# Altium project Keypadmacro.PrjPcb
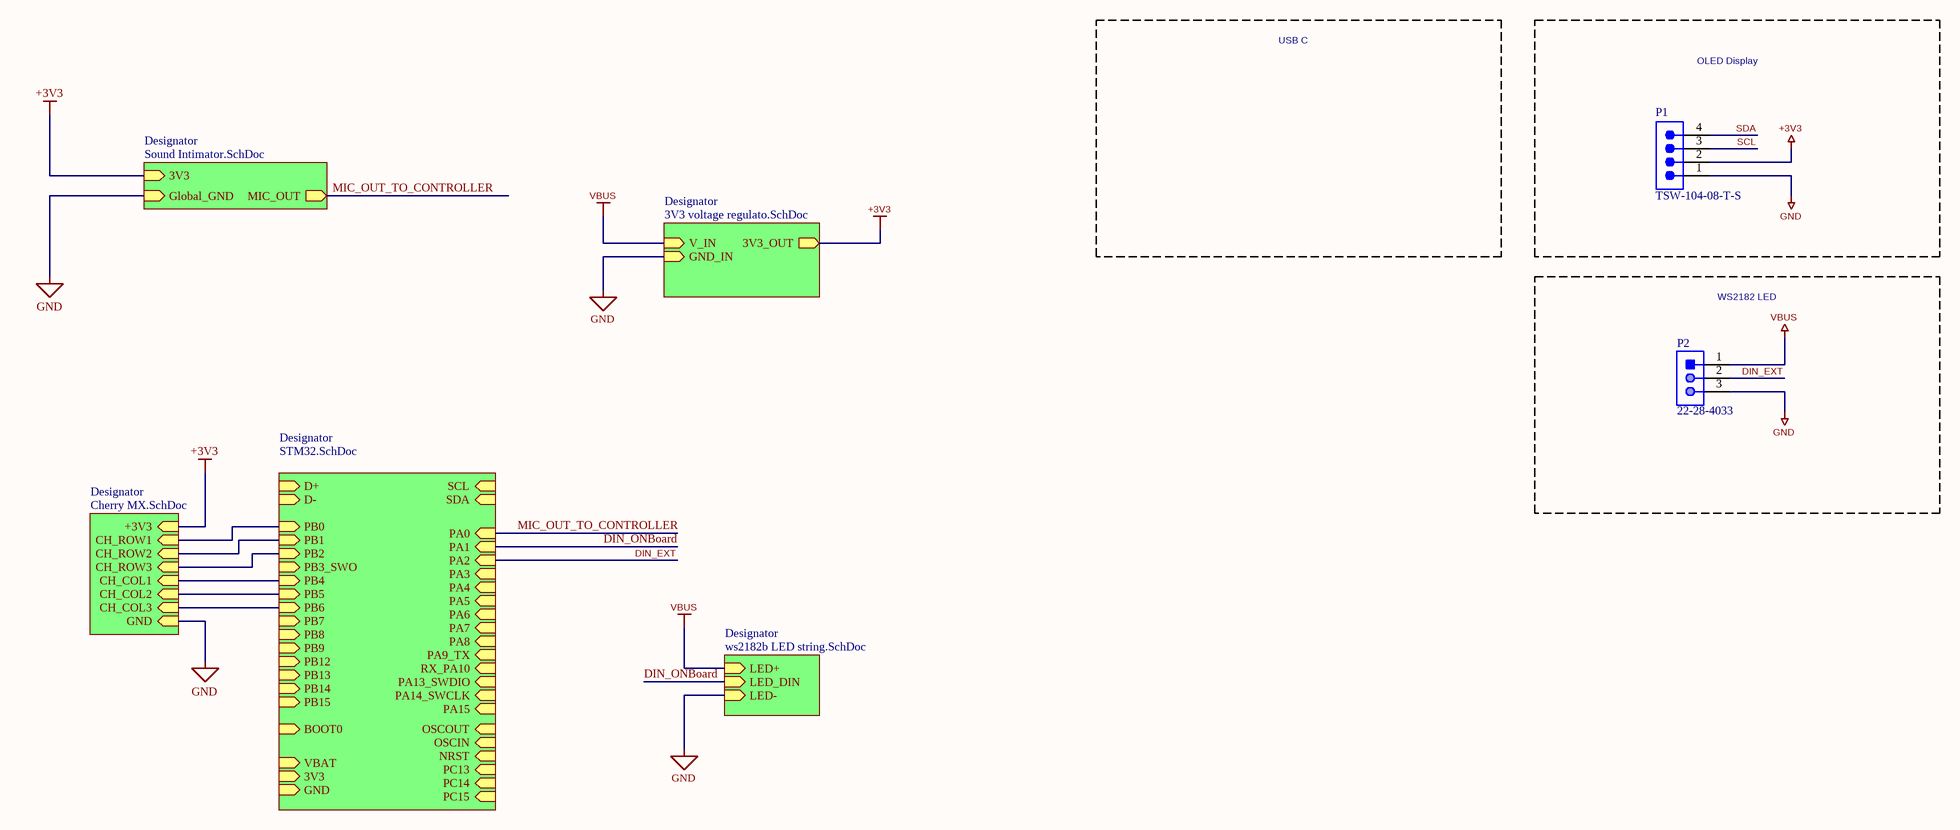
[diagram p0: Keypadmacro.SchDoc]
6 sheets, 73 parts. Net scope: hierarchical (ports join the sheet entries above them; power ports are global).
Board file: Keypadmacro.PcbDoc
Sheets:
  Keypadmacro.SchDoc
    Designator = Sound Intimator.SchDoc
    Designator = STM32.SchDoc
    Designator = Cherry MX.SchDoc
    Designator = 3V3 voltage regulato.SchDoc
    Designator = ws2182b LED string.SchDoc

## Sheet Keypadmacro.SchDoc
size 419 x 297 mm

### Parts
P1  TSW-104-08-T-S  [SMTC-TSW-104-08-X-S]
P2  22-28-4033  [MOLX-22-28-4033_V]

### Blocks framed on the sheet
OLED Display: P1
WS2182 LED: P2

### Sub-sheets
Designator = Sound Intimator.SchDoc: 3V3 (in), Global_GND (in), MIC_OUT (out)
Designator = STM32.SchDoc: 3V3 (in), VBAT (in), GND (in), D+ (in), D- (in), BOOT0 (in), NRST (in), PA0 (in), PA9_TX (in), PA6 (in), PA7 (in), PA1 (in), PA5 (in), PA3 (in), PA2 (in), PA4 (in), PA8 (in), PB13 (in), PB6 (in), PB9 (in), PB12 (in), PB14 (in), PB0 (in), PB4 (in), PB3_SWO (in), PB1 (in), PB8 (in), PB15 (in), PB5 (in), PB2 (in), PB7 (in), RX_PA10 (in), PC14 (in), PC15 (in), PA15 (in), PC13 (in), SCL (in), OSCIN (in), SDA (in), PA13_SWDIO (in), PA14_SWCLK (in), OSCOUT (in)
Designator = Cherry MX.SchDoc: CH_ROW2 (in), CH_COL3 (in), CH_ROW3 (in), GND (in), +3V3 (in), CH_COL2 (in), CH_ROW1 (in), CH_COL1 (in)
Designator = 3V3 voltage regulato.SchDoc: 3V3_OUT (out), GND_IN (in), V_IN (in)
Designator = ws2182b LED string.SchDoc: LED+ (in), LED_DIN (in), LED- (in)

### Nets
+3V3: P1.2 ; sheet Designator/3V3, sheet Designator/3V3, sheet Designator/VBAT, sheet Designator/+3V3, sheet Designator/3V3_OUT  [project net +3.3V]
GND: P1.1 P2.3 ; sheet Designator/Global_GND, sheet Designator/GND, sheet Designator/GND, sheet Designator/GND_IN, sheet Designator/LED-
VBUS: P2.1 ; sheet Designator/V_IN, sheet Designator/LED+  [project net +BATT]
CH_COL1: sheet Designator/PB4, sheet Designator/CH_COL1
CH_COL2: sheet Designator/PB5, sheet Designator/CH_COL2
CH_COL3: sheet Designator/PB6, sheet Designator/CH_COL3
CH_ROW1: sheet Designator/PB0, sheet Designator/CH_ROW1
CH_ROW2: sheet Designator/PB1, sheet Designator/CH_ROW2
CH_ROW3: sheet Designator/PB2, sheet Designator/CH_ROW3
DIN_EXT: P2.2 ; sheet Designator/PA2
DIN_ONBoard: sheet Designator/PA1, sheet Designator/LED_DIN  [project net D_IN]
MIC_OUT_TO_CONTROLLER: sheet Designator/MIC_OUT, sheet Designator/PA0
SCL: P1.3
SDA: P1.4

### Notes on the sheet
- USB C
- 1
- 2
- 3
- 4
- 5
- 6
- 7
- 8
- A
- B
- C
- D
- E
- Title:
- File: Keypadmacro.sch
- Sheet: /
- F
- KiCad E.D.A.  kicad (5.1.4)-1
- Size: A3
- Date:
- Rev:
- Id: 1/4

### Library data of the parts
P1 = CMP-1024-00356-1: 0.025" SQ Post Header, Through-hole, Vertical, -55 to 105 degC, 2.54 mm Pitch, 4-Pin, Male, RoHS; Manufacturer: Samtec; Pitch: 2.54 mm; PackageDescription: .025[0.64] SQ. Post Terminal Strip Assembly; ComponentLink2URL: http://www.samtec.com/documents/webfiles/pdf/TSW_TH.PDF; ComponentLink3URL: http://www.samtec.com/documents/webfiles/cpdf/TSW-XXX-XX-XXX-X-XX-XXX-MKT.pdf; PackageVersion: DM, 8/1988; ComponentLink3Description: Package Specification; DatasheetVersion: F-214; Orientation: Vertical; RoHS: True; Mounting Technology: Through-hole; ComponentLink1URL: http://www.samtec.com; PartNumber: TSW-104-08-T-S; ComponentLink1Description: Manufacturer URL; Temperature Range: -55 to 105 degC; ComponentLink2Description: Datasheet; PackageReference: TSW-104-08-X-S
P2 = CMP-1676-00001-5: Male Header, Pitch 2.54 mm, 1 x 3 Position, Height 8.38 mm, Tail Length 3.18 mm, RoHS, Bulk; Manufacturer: Molex; Rows: 1; Voltage Rating: 250 V; Current Rating: 4 A; Min Operating Temperature: 0 degC; Lead Pitch: 0.1 inch; Packaging: Bulk; Contact Finish: Gold; RoHSCompliant: true; Contact Material: Brass; PackageReference: 22-28-4033; REACH SVHC: Unknown; PackageDescription: Male Header, Pitch 2.54 mm, 1 x 3 Position, Height 8.38 mm, Tail Length 3.18 mm; ComponentLink2URL: http://www.molex.com/pdm_docs/sd/022284033_sd.pdf; Height: 8.38 mm; Mounting Technology: Through Hole; ComponentLink1Description: Manufacturer URL; Length: 7.62 mm; Mount: Through Hole; DatasheetVersion: Rev. G, 01/2012; Max Operating Temperature: 75 degC; ComponentLink2Description: Datasheet; Colour: Black; Pins: 3; Contact Plating: Gold; Package Quantity: 1; ComponentLink1URL: http://www.molex.com/

## Sheet Sound Intimator.SchDoc
size 297 x 210 mm
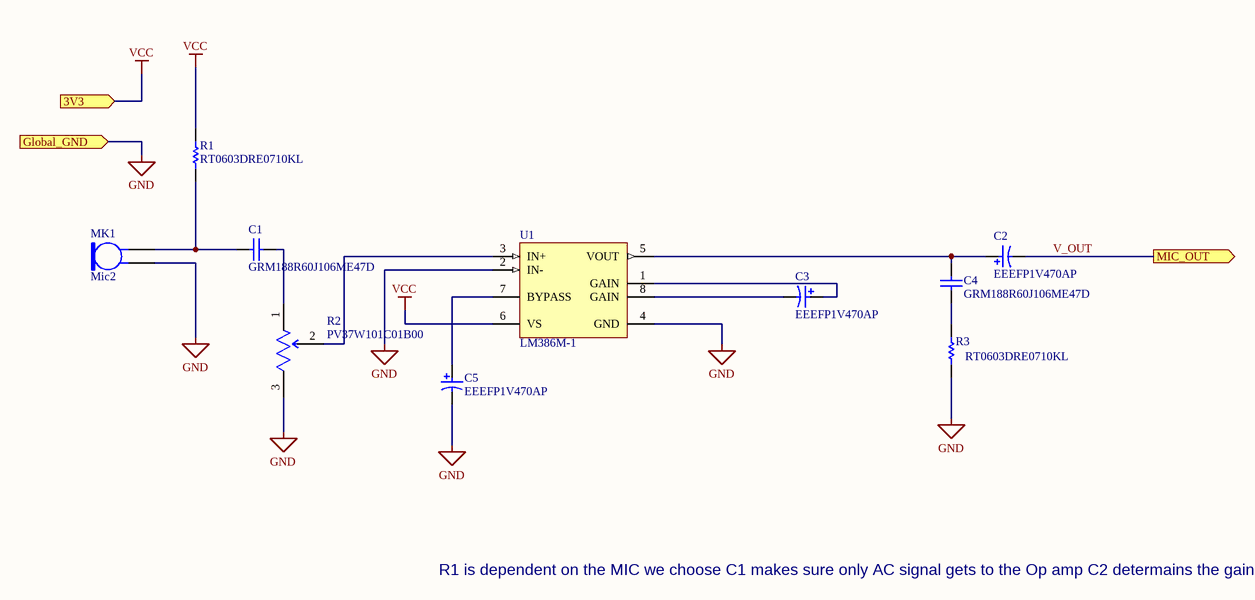
[diagram p1: Sound Intimator.SchDoc]

### Parts
C1  GRM188R60J106ME47D  [CAPC1608X90X35NL10T15]
C2  EEEFP1V470AP  [PNSC-FP-V-D_V]
C3  EEEFP1V470AP  [PNSC-FP-V-D_V]
C4  GRM188R60J106ME47D  [CAPC1608X90X35NL10T15]
C5  EEEFP1V470AP  [PNSC-FP-V-D_V]
MK1  Mic2  [PIN2]
R1  RT0603DRE0710KL  [RESC1608X55X25ML10T15]
R2  PV37W101C01B00  [FP-PV37W101C01B00-MFG]
R3  RT0603DRE0710KL  [RESC1608X55X25ML10T15]
U1  LM386M-1  [D0008A_M]

### Ports
3V3 (in), Global_GND (in), MIC_OUT (out)

### Nets
GND: C5.2 MK1.1 R2.3 R3.1 U1.2(IN-) U1.4(GND) ; port Global_GND
VCC: R1.2 U1.6(VS) ; port 3V3  [project net +3.3V]
V_OUT: C2.2 ; port MIC_OUT  [project net MIC_OUT_TO_CONTROLLER]
NetC1_1: C1.1 MK1.2 R1.1
NetC1_2: C1.2 R2.1
NetC2_1: C2.1 C4.2 U1.5(VOUT)
NetC3_1: C3.1 U1.1(GAIN)
NetC3_2: C3.2 U1.8(GAIN)
NetC4_1: C4.1 R3.2
NetC5_1: C5.1 U1.7(BYPASS)
NetR2_2: R2.2 U1.3(IN+)

### Notes on the sheet
- R1 is dependent on the MIC we choose
  C1 makes sure only AC signal gets to the Op amp
  C2 determains the gain of the OP Amp 20 to 200 gain
  C7 Is the Bypass Capacitor for stability of the op amp
  C3 removes the DC offset of the Output
- 1
- 2
- 3
- 4
- 5
- 6
- A
- B
- C
- D
- Title:
- File: Sound Intimator.sch
- Sheet: /
- KiCad E.D.A.  kicad (5.1.4)-1
- Size: A4
- Date:
- Rev:
- Id: 2/4

### Library data of the parts
C1 C4 = CMP-2006-02792-1: Manufacturer: Murata; Part Number: GRM188R60J106ME47D
C2 C3 C5 = CMP-2000-06216-1: Aluminum Electrolytic Capacitor, 47 uF, +/- 20%, 35 V, 2-Pin SMD (Size Code D), -55 to 105 degC, RoHS, Tape and Reel; Manufacturer: Panasonic; Lifetime@Temperature: 2000Hrs@105°C; Capacitance: 47µF; Type: Can; Rated Voltage: 35V; Ripple Current: 300mA; ESR (Equivalent Series Resistance): 0.26O; Package Reference: FP-V-D; Package Description: 2-Pin Electrolytic Aluminum Capacitor, Body 6.6 x 6.6 mm; Datasheet URL: http://industrial.panasonic.com/cdbs/www-data/pdf/RDE0000/ABA0000C1184.pdf; Series: FP; Operating Temp Range: -55to+105°C; Operating Temp-Max: 105°C; Datasheet Version: 03/2016; Manufacturer URL: http://www.panasonic.com/; Package URL: http://industrial.panasonic.com/cdbs/www-data/pdf/RDE0000/DME0000COL48.pdf; Case Size/Dimension: Ø6.3x5.8mm; Mounting Technology: SurfaceMount
MK1 = Mic2: Microphone; Published: 24-Mar-1999; LatestRevisionDate: 17-Jul-2002; LatestRevisionNote: Re-released for DXP Platform.; PackageReference: PIN2; Publisher: Altium Limited
R1 R3 = CMP-2000-04608-1: Manufacturer: Yageo; Part Number: RT0603DRE0710KL
R2 = CMP-06028-000002-1: TRIMMER 100 OHM 0.25W PC PIN TOP; Power Rating: 250mW; Number of Turns: 12; Temperature Coefficient: 150ppm/°C; Resistance: 100R; Tolerance: 10%; Max Operating Temperature: 125°C; Lead Free: Lead Free; Mount: Through Hole; Width: 0.157inch; Composition: Cermet; Package Quantity: 50; Color: Grey; Weight: 340mg; Max Power Dissipation: 250mW; Radiation Hardening: No; Min Operating Temperature: -55°C; Height: 0.264inch; Packaging: Bulk; Length: 0.252inch; Termination: PC Pin; Taper: Linear
U1 = CMP-0057-00421-3: Low Voltage Audio Power Amplifier, 8-pin Narrow SOIC; Manufacturer: Texas Instruments; PackageTopMarking: NSZXTT*LM386*M-1; CompType: Audio IC; PowerWise: N; ComponentLink1Description: Datasheet URL; Code_IPC: SOIC127P600-8; PackageDescription: SOIC Narrow, 4.9 x 3.9 x 1.45mm, 8 Lead, 1.27mm Pitch; Code_JEDEC: MS-012-AA; PinCount: 8; ComponentLink1URL: http://www.ti.com/general/docs/lit/getliterature.tsp?genericPartNumber=LM386&fileType=pdf; RoHS: N; PackageReference: D0008A

## Sheet STM32.SchDoc
size 297 x 210 mm
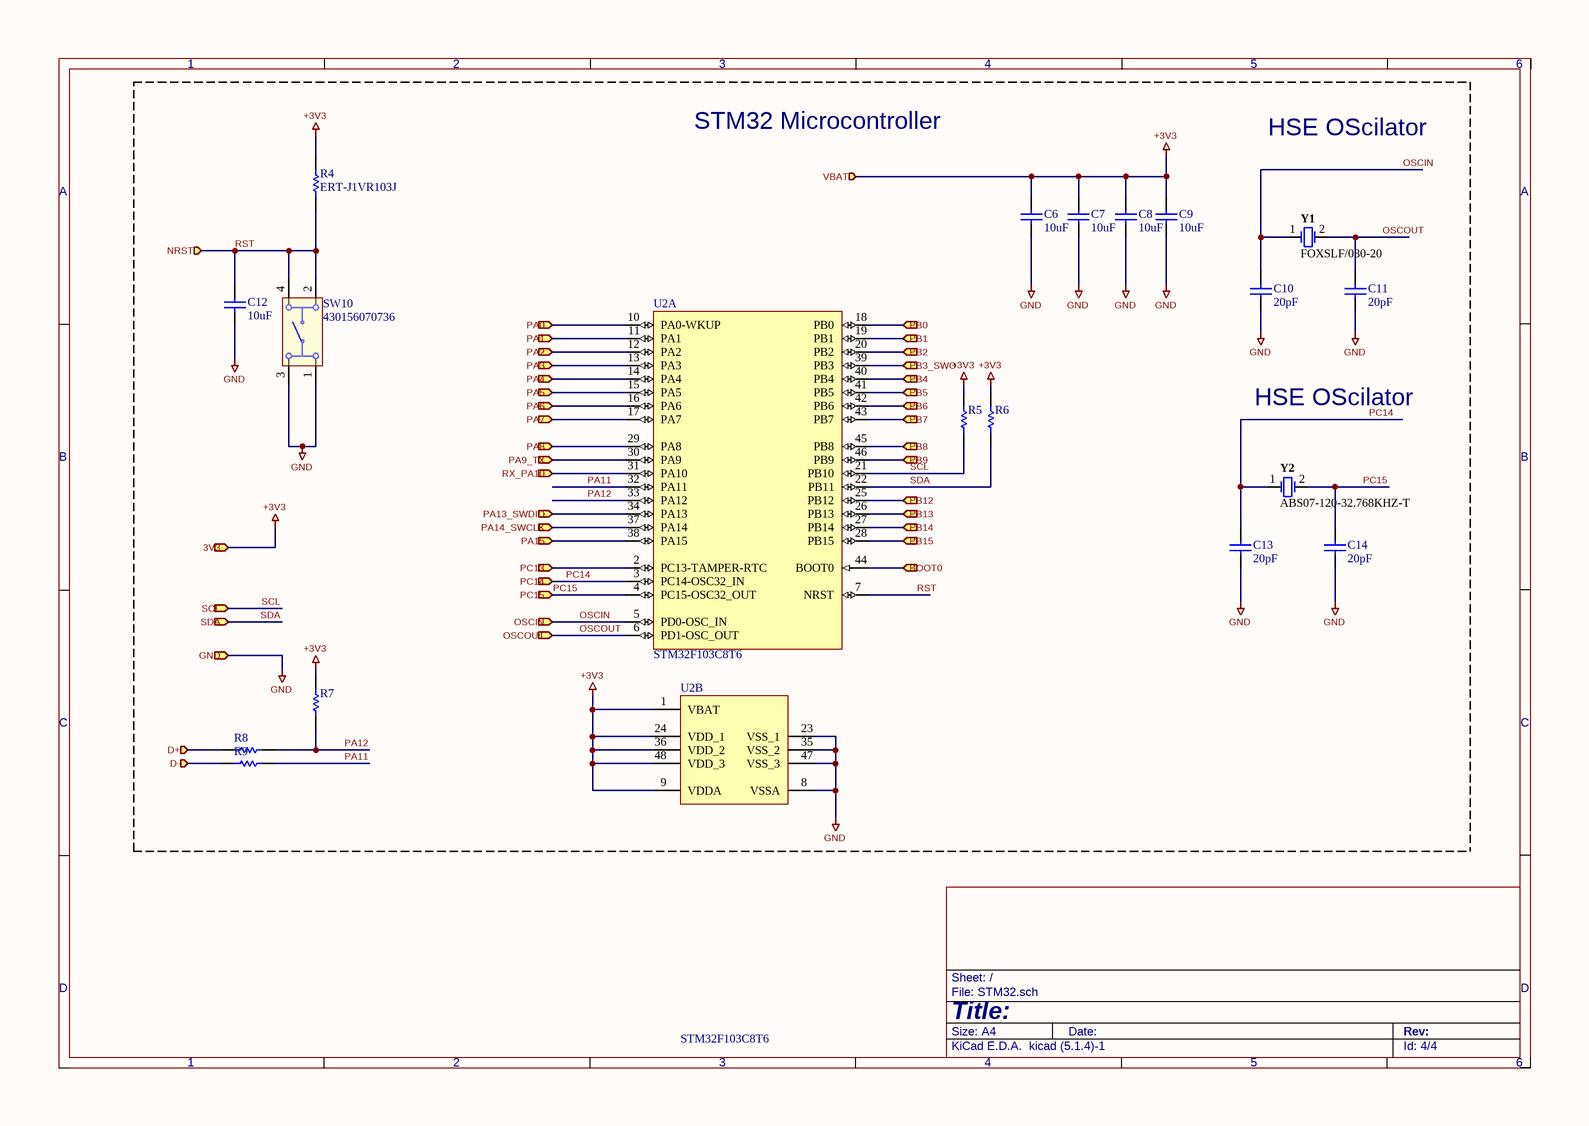
[diagram p2: STM32.SchDoc]

### Parts
C6  10uF  [CAPC1608X90X35NL10T15]
C7  10uF  [CAPC1608X90X35NL10T15]
C8  10uF  [CAPC1608X90X35NL10T15]
C9  10uF  [CAPC1608X90X35NL10T15]
C10  20pF  [CAPC1608X90X35NL10T15]
C11  20pF  [CAPC1608X90X35NL10T15]
C12  10uF  [CAPC1608X90X35NL10T15]
C13  20pF  [CAPC1608X90X35NL10T15]
C14  20pF  [CAPC1608X90X35NL10T15]
R4  ERT-J1VR103J  [RESC1608X90X30LL15T20]
R5  ERT-J1VR103J  [RESC1608X90X30LL15T20]  (value not drawn)
R6  ERT-J1VR103J  [RESC1608X90X30LL15T20]  (value not drawn)
R7  ERT-J1VR103J  [RESC1608X90X30LL15T20]  (value not drawn)
R8  ERT-J1VR103J  [RESC1608X90X30LL15T20]  (value not drawn)
R9  ERT-J1VR103J  [RESC1608X90X30LL15T20]  (value not drawn)
SW10  430156070736  [430156070736]
U2  STM32F103C8T6  [STM-LQFP48_L]  (parts A,B of 2)
Y1  FOXSLF/080-20  [FOX-FOXSLF080-20]
Y2  ABS07-120-32.768KHZ-T  [ABRA-ABS07_A_V]

### Ports
3V3 (in), BOOT0 (in), D+ (in), D- (in), GND (in), NRST (in), OSCIN (in), OSCOUT (in), PA0 (in), PA1 (in), PA2 (in), PA3 (in), PA4 (in), PA5 (in), PA6 (in), PA7 (in), PA8 (in), PA9_TX (in), PA13_SWDIO (in), PA14_SWCLK (in), PA15 (in), PB0 (in), PB1 (in), PB2 (in), PB3_SWO (in), PB4 (in), PB5 (in), PB6 (in), PB7 (in), PB8 (in), PB9 (in), PB12 (in), PB13 (in), PB14 (in), PB15 (in), PC13 (in), PC14 (in), PC15 (in), RX_PA10 (in), SCL (in), SDA (in), VBAT (in)

### Nets
+3V3: C6.2 C7.2 C8.2 C9.2 R4.2 R5.2 R6.2 R7.2 U2.1(VBAT) U2.9(VDDA) U2.24(VDD_1) U2.36(VDD_2) U2.48(VDD_3) ; port VBAT, port 3V3  [project net +3.3V]
GND: C6.1 C7.1 C8.1 C9.1 C10.1 C11.1 C12.1 C13.1 C14.1 SW10.1 SW10.3 U2.8(VSSA) U2.23(VSS_1) U2.35(VSS_2) U2.47(VSS_3) ; port GND
BOOT0: U2.44(BOOT0) ; port BOOT0
CH_COL1: U2.40(PB4) ; port PB4
CH_COL2: U2.41(PB5) ; port PB5
CH_COL3: U2.42(PB6) ; port PB6
CH_ROW1: U2.18(PB0) ; port PB0
CH_ROW2: U2.19(PB1) ; port PB1
CH_ROW3: U2.20(PB2) ; port PB2
D+: R8.2 ; port D+
D-: R9.2 ; port D-
D_IN: U2.11(PA1) ; port PA1
DIN_EXT: U2.12(PA2) ; port PA2
MIC_OUT_TO_CONTROLLER: U2.10(PA0-WKUP) ; port PA0
OSCIN: C10.2 U2.5(PD0-OSC_IN) Y1.1 ; port OSCIN
OSCOUT: C11.2 U2.6(PD1-OSC_OUT) Y1.2 ; port OSCOUT
PA3: U2.13(PA3) ; port PA3
PA4: U2.14(PA4) ; port PA4
PA5: U2.15(PA5) ; port PA5
PA6: U2.16(PA6) ; port PA6
PA7: U2.17(PA7) ; port PA7
PA8: U2.29(PA8) ; port PA8
PA9_TX: U2.30(PA9) ; port PA9_TX
PA11: R9.1 U2.32(PA11)
PA12: R7.1 R8.1 U2.33(PA12)
PA13_SWDIO: U2.34(PA13) ; port PA13_SWDIO
PA14_SWCLK: U2.37(PA14) ; port PA14_SWCLK
PA15: U2.38(PA15) ; port PA15
PB3_SWO: U2.39(PB3) ; port PB3_SWO
PB7: U2.43(PB7) ; port PB7
PB8: U2.45(PB8) ; port PB8
PB9: U2.46(PB9) ; port PB9
PB12: U2.25(PB12) ; port PB12
PB13: U2.26(PB13) ; port PB13
PB14: U2.27(PB14) ; port PB14
PB15: U2.28(PB15) ; port PB15
PC13: U2.2(PC13-TAMPER-RTC) ; port PC13
PC14: C13.2 U2.3(PC14-OSC32_IN) Y2.1 ; port PC14
PC15: C14.2 U2.4(PC15-OSC32_OUT) Y2.2 ; port PC15
RST: C12.2 R4.1 SW10.2 SW10.4 U2.7(NRST) ; port NRST
RX_PA10: U2.31(PA10) ; port RX_PA10
SCL: R5.1 U2.21(PB10) ; port SCL
SDA: R6.1 U2.22(PB11) ; port SDA

### Notes on the sheet
- STM32 Microcontroller
- HSE OScilator
- 1
- 2
- 3
- 4
- 5
- 6
- A
- B
- C
- D
- Title:
- File: STM32.sch
- Sheet: /
- KiCad E.D.A.  kicad (5.1.4)-1
- Size: A4
- Date:
- Rev:
- Id: 4/4

### Library data of the parts
C6-C14 = CMP-2006-02792-1: Part Number: GRM188R60J106ME47D; Manufacturer: Murata
R4-R9 = CMP-2000-00869-1: Manufacturer: Panasonic; Part Number: ERT-J1VR103J
SW10 = CMP-1453-00006-1: WS-TATV THT Tact Switch 6X6 mm; Manufacturer: Wuerth Elektronik; NoPins: 04; ComponentLink2URL: http://katalog.we-online.de/em/datasheet/4301x6.pdf; ComponentLink1Description: Manufacturer URL; PackageReference: 430156070736; ComponentLink2Description: Datasheet; PartNumber: 430156070736; ComponentLink1URL: http://www.we-online.com
U2 = CMP-0237-00215-3: ARM Cortex-M3 32-bit MCU, 64 KB Flash, 20 KB Internal RAM, 37 I/Os, 48-pin LQFP, -40 to 85 degC, Tray; Supply Voltage(Vcc) min (V): 2; Internal RAM Size (kB): 20; FLASH Size (Prog) (kB): 64; A/D Converter: 2x12-bit (10 Channel); I/Os (High Current): 37; Operating Frequency(F) (Processor speed) (MHz): 72; Core: ARM Cortex-M3; ComponentLink3Description: Package Specification; Mounting Technology: Surface Mount; PartNumber: STM32F103C8T6; PackageReference: LQFP48; Packing: Tray; ComponentLink3URL: http://www.st.com/st-web-ui/static/active/en/resource/technical/document/datasheet/DM00058181.pdf; DatasheetVersion: Rev. 16; ComponentLink1URL: http://www.st.com/web/en/home.html; PackageVersion: Rev. 6, 06/2013; ComponentLink2URL: http://www.st.com/st-web-ui/static/active/en/resource/technical/document/datasheet/CD00161566.pdf; ComponentLink1Description: Manufacturer URL; ComponentLink2Description: Datasheet; PackageDescription: 48-Pin Low Profile Quad Flat Package, 7 x 7 mm Body, 0.5 mm Pitch
Y1 = CMP-1749-00002-1: Resistance Weld Thru-Hole Crystal, 8 MHz, -20 to 70 degC, 2-Pin THD, RoHS, Bulk; Dropout Voltage: 2 V; Outputs: 1; Nominal Output Voltage: 5 V; Min Input Voltage: 7 V; Case\Package: TO-263-3; Max Input Voltage: 35 V; Max Ouput Current: 1 A; Length: 10.24 mm; Max Operating Temperature: 125 degC; Mount: Surface Mount; PackageDescription: 2-Pin Through Hole Device, Body 11.35 x 4.65 mm; Package Quantity: 50; Pins: 3; ComponentLink2URL: http://download.siliconexpert.com/pdfs/2015/4/5/6/5/7/200/fox_/manual/35607121449963728hc49slf.pdf; PackageReference: FOXSLF080-20; Min Operating Temperature: 0 degC; Height: 30.02 mm; Packaging: Rail/Tube; Radiation Hardening: No; Width: 9.35 mm; ComponentLink1URL: http://www.foxonline.com/; DatasheetVersion: Mar-15; ComponentLink1Description: Manufacturer URL; Output Voltage: 5 V; RoHSCompliant: true; REACH SVHC: No SVHC; Output Current: 1 A; ComponentLink2Description: Datasheet
Y2 = CMP-2000-07587-1: Tuning Fork Crystal, 32.768 KHz, +/- 20 ppm, -40 to 85 degC, 2-Pin SMD, RoHS, Tape and Reel; Manufacturer: Abracon; Case\/Package: SMD/SMT; Series Resistance: 60KOhm; Frequency Tolerance: 20ppm; Load Capacitance: 6pF; ESR (Equivalent Series Resistance): 55KOhm; Max Operating Temperature: 85degC; Width: 0.061inch; Radiation Hardening: No; Lead Free: LeadFree; RoHSCompliant: True; Depth: 1.5mm; Datasheet URL: http://www.abracon.com/Resonators/ABS07-120-32.768kHz-T.pdf; Frequency: 32.768KHz; Termination: SMD/SMT; Manufacturer URL: http://www.abracon.com/; Package Quantity: 3000; Packaging: TapeandReel; Number of Pins: 2; Height: 0.035inch; Package Description: 2-Pin Surface Mount Device, Body 3.2 x 1.5 mm; Package Reference: ABS07; Mount: SurfaceMount; Tolerance: 20ppm; Mounting Technology: SurfaceMount; REACH SVHC: NoSVHC; Datasheet Version: 11/2014; Length: 3.2mm; Min Operating Temperature: -40degC

## Sheet Cherry MX.SchDoc
size 297 x 210 mm
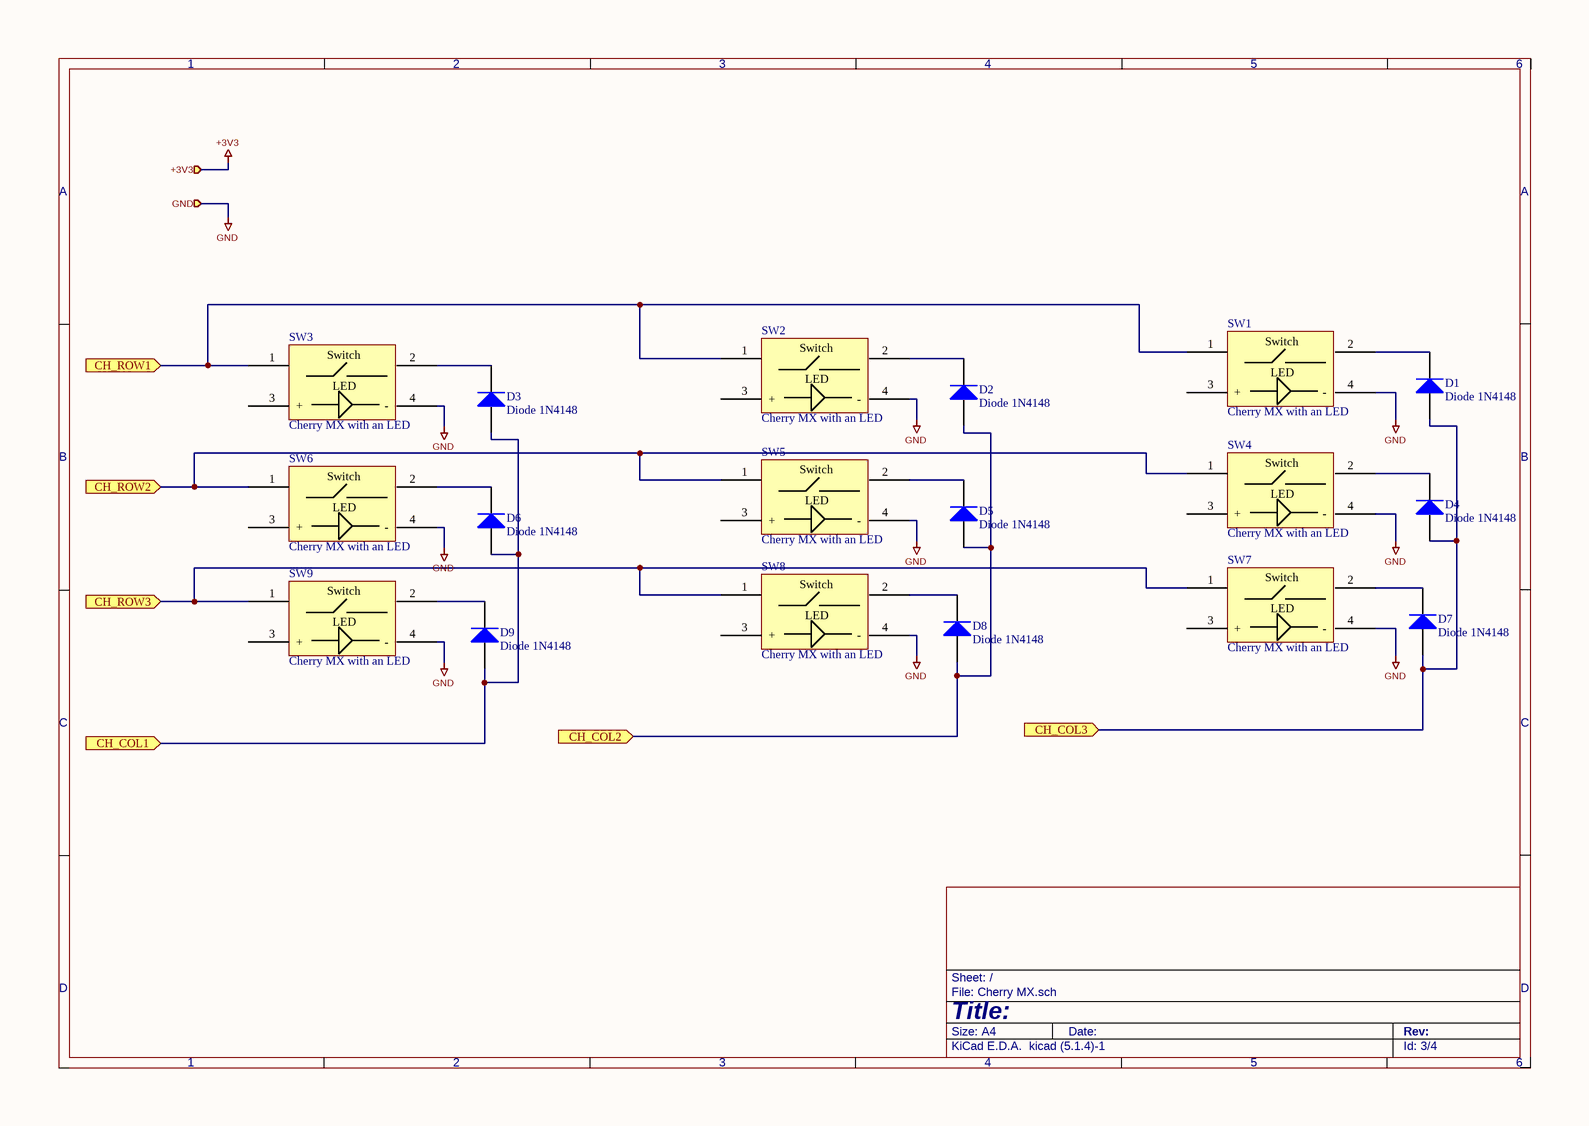
[diagram p3: Cherry MX.SchDoc]

### Parts
D1  Diode 1N4148  [DO-35]
D2  Diode 1N4148  [DO-35]
D3  Diode 1N4148  [DO-35]
D4  Diode 1N4148  [DO-35]
D5  Diode 1N4148  [DO-35]
D6  Diode 1N4148  [DO-35]
D7  Diode 1N4148  [DO-35]
D8  Diode 1N4148  [DO-35]
D9  Diode 1N4148  [DO-35]
SW1  Cherry MX with an LED  [MX_Cherry_LED]
SW2  Cherry MX with an LED  [MX_Cherry_LED]
SW3  Cherry MX with an LED  [MX_Cherry_LED]
SW4  Cherry MX with an LED  [MX_Cherry_LED]
SW5  Cherry MX with an LED  [MX_Cherry_LED]
SW6  Cherry MX with an LED  [MX_Cherry_LED]
SW7  Cherry MX with an LED  [MX_Cherry_LED]
SW8  Cherry MX with an LED  [MX_Cherry_LED]
SW9  Cherry MX with an LED  [MX_Cherry_LED]

### Ports
+3V3 (in), CH_COL1 (in), CH_COL2 (in), CH_COL3 (in), CH_ROW1 (in), CH_ROW2 (in), CH_ROW3 (in), GND (in)

### Nets
GND: SW1.4(-) SW2.4(-) SW3.4(-) SW4.4(-) SW5.4(-) SW6.4(-) SW7.4(-) SW8.4(-) SW9.4(-) ; port GND
CH_COL1: D3.1(A) D6.1(A) D9.1(A) ; port CH_COL1
CH_COL2: D2.1(A) D5.1(A) D8.1(A) ; port CH_COL2
CH_COL3: D1.1(A) D4.1(A) D7.1(A) ; port CH_COL3
CH_ROW1: SW1.1 SW2.1 SW3.1 ; port CH_ROW1
CH_ROW2: SW4.1 SW5.1 SW6.1 ; port CH_ROW2
CH_ROW3: SW7.1 SW8.1 SW9.1 ; port CH_ROW3
NetD1_2: D1.2(K) SW1.2
NetD2_2: D2.2(K) SW2.2
NetD3_2: D3.2(K) SW3.2
NetD4_2: D4.2(K) SW4.2
NetD5_2: D5.2(K) SW5.2
NetD6_2: D6.2(K) SW6.2
NetD7_2: D7.2(K) SW7.2
NetD8_2: D8.2(K) SW8.2
NetD9_2: D9.2(K) SW9.2

Not connected (* = marked no-connect by the designer): SW1 3(+); SW2 3(+); SW3 3(+); SW4 3(+); SW5 3(+); SW6 3(+); SW7 3(+); SW8 3(+); SW9 3(+)

### Notes on the sheet
- 1
- 2
- 3
- 4
- 5
- 6
- A
- B
- C
- D
- Title:
- File: Cherry MX.sch
- Sheet: /
- KiCad E.D.A.  kicad (5.1.4)-1
- Size: A4
- Date:
- Rev:
- Id: 3/4
- (in symbol MX_Cherry_LED) Switch; LED

### Library data of the parts
D1-D9 = Diode 1N4148: High Conductance Fast Diode; Published: 8-Jun-2000; LatestRevisionDate: 17-Jul-2002; LatestRevisionNote: Re-released for DXP Platform.; DatasheetVersion: 1997; PackageReference: DO-35; Publisher: Altium Limited; PackageDescription: Diode, Axial; Body 3.8 x 1.9 mm (LxDia. max), Lead Dia. 0.53 mm (max); Code_JEDEC: DO-204-AH; ComponentLink1Description: Manufacturer Link; ComponentLink1URL: http://www.fairchildsemi.com/; ComponentLink2Description: Datasheet; ComponentLink2URL: http://www.fairchildsemi.com/ds/1N%2F1N4148.pdf
SW1-SW9 = MX_Cherry_LED

## Sheet 3V3 voltage regulato.SchDoc
size A4
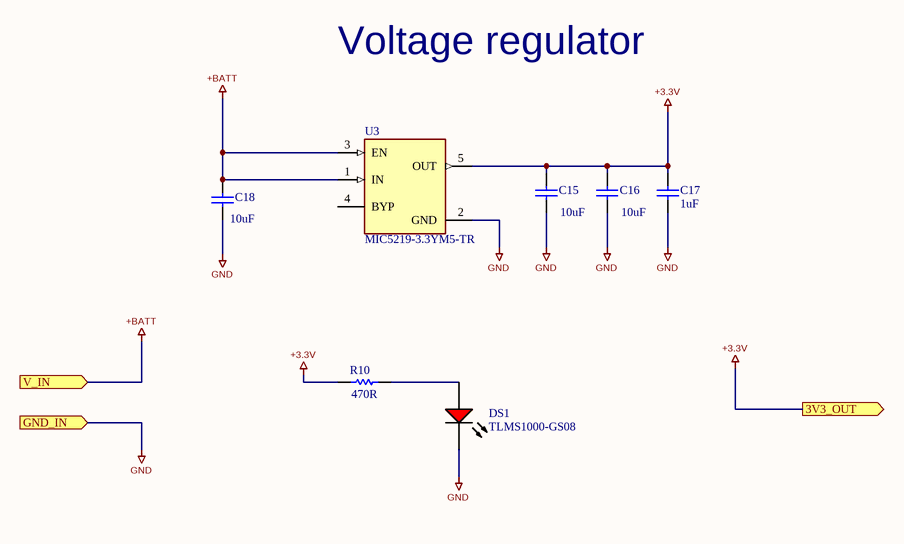
[diagram p4: 3V3 voltage regulato.SchDoc]

### Parts
C15  10uF  [CAPC1608X90X35NL10T15]
C16  10uF  [CAPC1608X90X35NL10T15]
C17  1uF  [CAPC1608X90X35LL10T15]
C18  10uF  [CAPC1608X90X35NL10T15]
DS1  TLMS1000-GS08  [VISH-TLMS1000_V]
R10  470R  [RESC1608X55X25LL10T15]
U3  MIC5219-3.3YM5-TR  [FP-SOT23-5LD-PL-1-IPC_C]

### Ports
3V3_OUT (out), GND_IN (in), V_IN (in)

### Nets
+3.3V: C15.2 C16.2 C17.2 R10.1 U3.5(OUT) ; port 3V3_OUT
+BATT: C18.2 U3.1(IN) U3.3(EN) ; port V_IN
GND: C15.1 C16.1 C17.1 C18.1 DS1.2(K) U3.2(GND) ; port GND_IN
NetDS1_1: DS1.1(A) R10.2

Not connected (* = marked no-connect by the designer): U3 4(BYP)

### Notes on the sheet
- Voltage regulator

### Library data of the parts
C15 C16 C18 = CMP-2006-02792-1: as C6 on sheet STM32
C17 = CMP-2006-02459-1: Manufacturer: Murata; Part Number: GRM188R61E105KA12D
DS1 = CMP-2000-07254-1: Low Current LED, 40 mW, 1.8 V, -40 to 100 degC, 2-Pin SMD (0603), RoHS, Tape and Reel; Manufacturer: Vishay; Lens Shape: Rectangular; Automotive Qualification Standard: AEC-Q100; Wavelength Typ: 636nm; SVHC: ToBeAdvised; LED Colour: Red; Bulb Size: 1.6mmx0.8mm; Forward Voltage: 1.8V; Luminous Intensity: 4mcd; Forward Current If: 2mA; Viewing Angle: 80°; Datasheet Version: Rev. 1.7, 02/2011; Datasheet URL: https://datasheet.ciiva.com/5798/1698881-5798337.pdf; LED Mounting: SMD; Packaging: CutTape; Package Reference: TLMS1000; Manufacturer URL: http://www.vishay.com/; Mounting Technology: SurfaceMount; Product Range: -; Package Description: 2-Pin Surface Mount Device, Body 1.6 x 0.8 mm; MSL: MSL2-1year
R10 = CMP-1659-00035-1: General Purpose Chip Resistor, 470 Ohm, +/- 1%, -55 to 155 degC, 0603 (1608 Metric), RoHS, Tape and Reel; Impedance: 50 Ohm; Fastening Type: Snap; Min Operating Temperature: -40 degC; Length: 3 mm; PackageReference: 0603; Contact Material: Brass; Max Operating Temperature: 90 degC; ComponentLink2URL: https://datasheet.ciiva.com/11808/0900766b80f96399-11808177.pdf; Packaging: Tape and Reel; DatasheetVersion: Rev. 4, 04/2009; Contact Plating: Gold; Radiation Hardening: No; Height: 1.25 mm; Resistance: 50 Ohm; RoHSCompliant: true; ComponentLink2Description: Datasheet; Package Quantity: 2500; ComponentLink1URL: http://www.yageo.com/; Width: 3.1 mm; Mount: Surface Mount; PackageDescription: 2-Pin Surface Mount Device, Body 1.6 x 0.8 mm; ComponentLink1Description: Manufacturer URL
U3 = CMP-06324-000027-1: IC REG LINEAR 3.3V 500MA SOT23-5; Dropout Voltage: 350mV; Output Type: Fixed; Number of Regulators: 1; Max Input Voltage: 12V; Min Input Voltage: 2.5V; Min Operating Temperature: -40°C; Nominal Output Voltage: 3.3V; Output Voltage: 3.3V; Packaging: Cut Tape; Mount: Surface Mount; Number of Pins: 5; Case/Package: SOT-23-5; Lead Free: Lead Free; Max Operating Temperature: 125°C; REACH SVHC: No SVHC; Output Current: 500mA

## Sheet ws2182b LED string.SchDoc
size A4
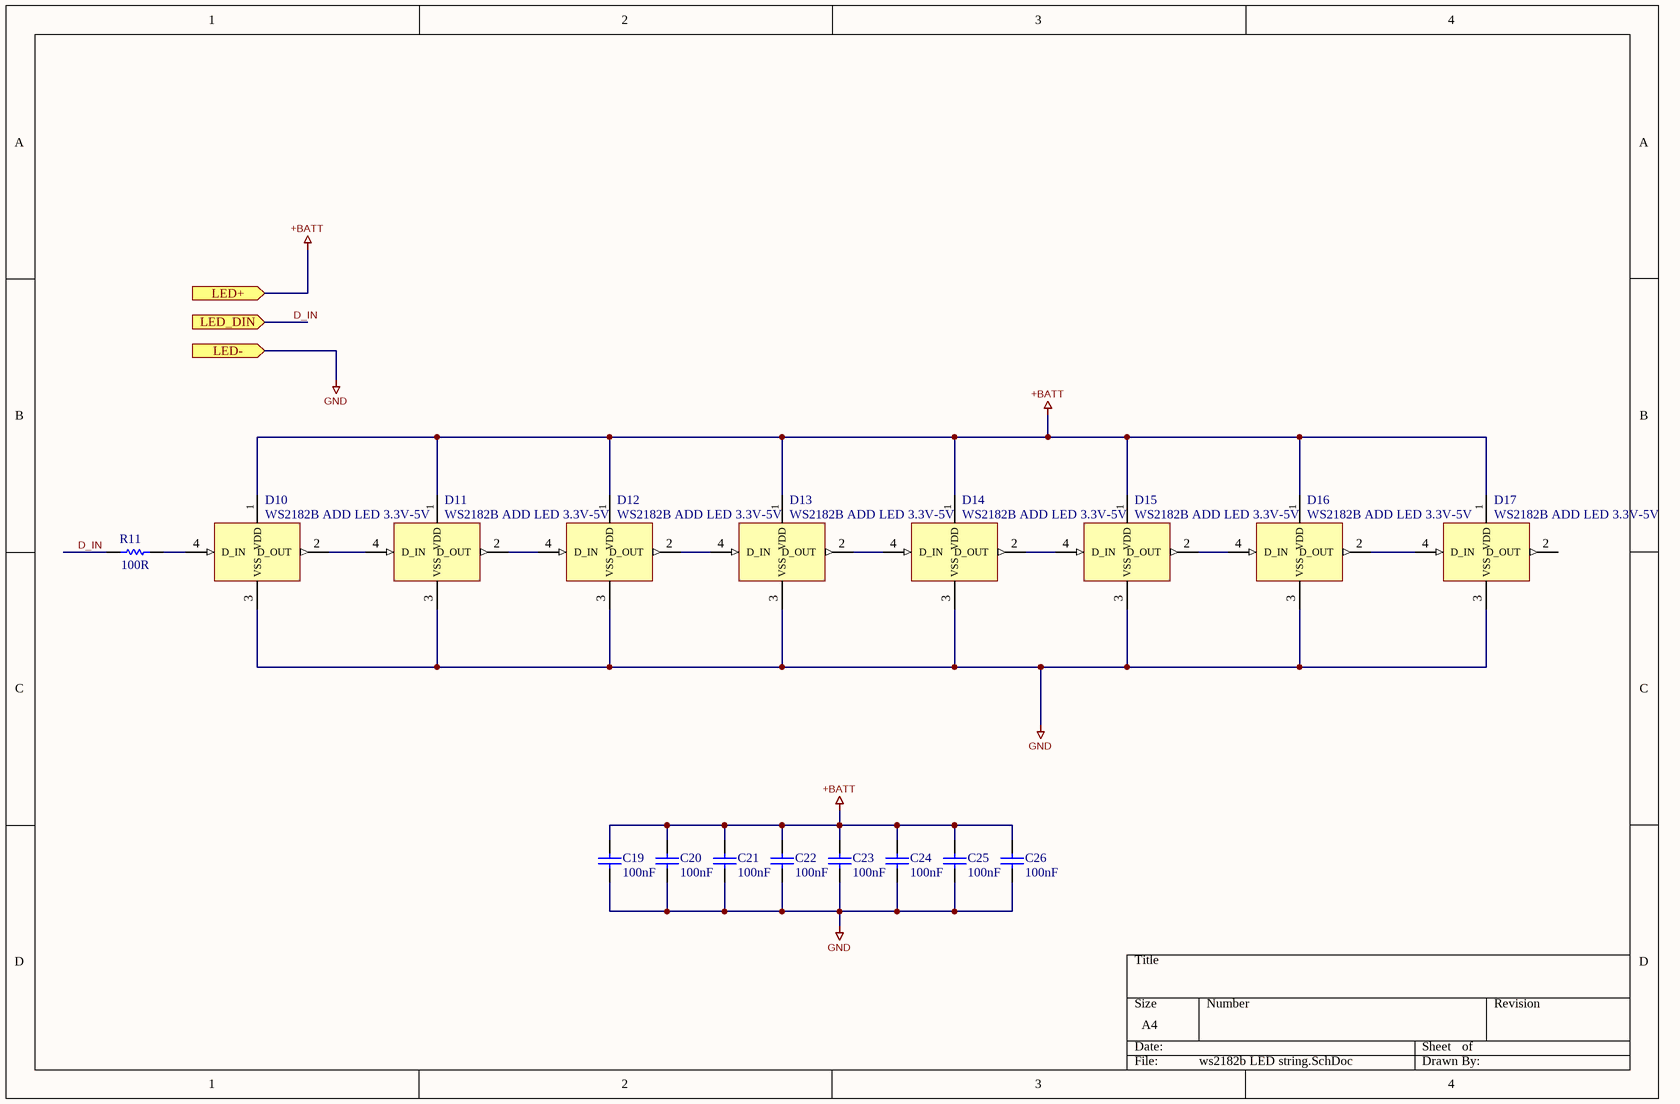
[diagram p5: ws2182b LED string.SchDoc]

### Parts
C19  100nF  [CAPC1608X90X20LL10]
C20  100nF  [CAPC1608X90X20LL10]
C21  100nF  [CAPC1608X90X20LL10]
C22  100nF  [CAPC1608X90X20LL10]
C23  100nF  [CAPC1608X90X20LL10]
C24  100nF  [CAPC1608X90X20LL10]
C25  100nF  [CAPC1608X90X20LL10]
C26  100nF  [CAPC1608X90X20LL10]
D10  WS2182B ADD LED 3.3V-5V  [WS2182B]
D11  WS2182B ADD LED 3.3V-5V  [WS2182B]
D12  WS2182B ADD LED 3.3V-5V  [WS2182B]
D13  WS2182B ADD LED 3.3V-5V  [WS2182B]
D14  WS2182B ADD LED 3.3V-5V  [WS2182B]
D15  WS2182B ADD LED 3.3V-5V  [WS2182B]
D16  WS2182B ADD LED 3.3V-5V  [WS2182B]
D17  WS2182B ADD LED 3.3V-5V  [WS2182B]
R11  100R  [RESC1608X55X25LL10T15]

### Ports
LED+ (in), LED- (in), LED_DIN (in)

### Nets
+BATT: C19.2 C20.2 C21.2 C22.2 C23.2 C24.2 C25.2 C26.2 D10.1(VDD) D11.1(VDD) D12.1(VDD) D13.1(VDD) D14.1(VDD) D15.1(VDD) D16.1(VDD) D17.1(VDD) ; port LED+
GND: C19.1 C20.1 C21.1 C22.1 C23.1 C24.1 C25.1 C26.1 D10.3(VSS) D11.3(VSS) D12.3(VSS) D13.3(VSS) D14.3(VSS) D15.3(VSS) D16.3(VSS) D17.3(VSS) ; port LED-
D_IN: R11.1 ; port LED_DIN
NetD10_2: D10.2(D_OUT) D11.4(D_IN)
NetD10_4: D10.4(D_IN) R11.2
NetD11_2: D11.2(D_OUT) D12.4(D_IN)
NetD12_2: D12.2(D_OUT) D13.4(D_IN)
NetD13_2: D13.2(D_OUT) D14.4(D_IN)
NetD14_2: D14.2(D_OUT) D15.4(D_IN)
NetD15_2: D15.2(D_OUT) D16.4(D_IN)
NetD16_2: D16.2(D_OUT) D17.4(D_IN)

Not connected (* = marked no-connect by the designer): D17 2(D_OUT)

### Library data of the parts
C19-C26 = CMP-2000-07546-1: Chip Capacitor, 0.1 uF, +/- 10%, 50 V, -55 to 125 degC, 0603 (1608 Metric), RoHS, Tape and Reel; Manufacturer: TDK; Voltage: 50V; Dielectric: X7R; Package Reference: 603; Radiation Hardening: No; Composition: Ceramic; Datasheet URL: https://product.tdk.com/info/en/catalog/datasheets/mlcc_automotive_general_en.pdf; Mounting Technology: SurfaceMount; Datasheet Version: 12/2014; Width: 0.8mm; Length: 1.6mm; Capacitance: 100nF; Tolerance: 10%; Case Code (Imperial): 0603; RoHSCompliant: True; Min Operating Temperature: -55degC; Package Description: 2-Pin Surface Mount Device, Body 1.6 x 0.8 mm; Packaging: TapeandReel; Package Quantity: 1; Voltage Rating: 50V; Mount: SurfaceMount; Lead Free: LeadFree; Depth: 0.8mm; Termination: SMD/SMT; Case Code (Metric): 1608; Thickness: 0.035inch; Height: 0.8mm; Weight: 7.1E-05oz; Voltage Rating (DC): 50V; REACH SVHC: NoSVHC; Manufacturer URL: http://www.tdk.com/; Case/Package: 0603; Max Operating Temperature: 125degC
D10-D17 = WS2182B
R11 = CMP-1659-00035-1: as R10 on sheet 3V3 voltage regulato; Fastening Type: Snap; Min Operating Temperature: -40 degC; Length: 3 mm; PackageReference: 0603; Contact Material: Brass; Max Operating Temperature: 90 degC; ComponentLink2URL: https://datasheet.ciiva.com/11808/0900766b80f96399-11808177.pdf; Packaging: Tape and Reel; DatasheetVersion: Rev. 4, 04/2009; Contact Plating: Gold; Radiation Hardening: No; Height: 1.25 mm; Resistance: 50 Ohm; RoHSCompliant: true; ComponentLink2Description: Datasheet; Package Quantity: 2500; ComponentLink1URL: http://www.yageo.com/; Width: 3.1 mm; Mount: Surface Mount; PackageDescription: 2-Pin Surface Mount Device, Body 1.6 x 0.8 mm; ComponentLink1Description: Manufacturer URL

## Nets that join several sheets
+3.3V: Keypadmacro (P1.2), Sound Intimator (R1.2 U1.6), STM32 (13 pins), 3V3 voltage regulato (5 pins)
+BATT: Keypadmacro (P2.1), 3V3 voltage regulato (C18.2 U3.1 U3.3), ws2182b LED string (16 pins)
GND: Keypadmacro (P1.1 P2.3), Sound Intimator (6 pins), STM32 (15 pins), Cherry MX (9 pins), 3V3 voltage regulato (6 pins), ws2182b LED string (16 pins)
CH_COL1: STM32 (U2.40), Cherry MX (D3.1 D6.1 D9.1)
CH_COL2: STM32 (U2.41), Cherry MX (D2.1 D5.1 D8.1)
CH_COL3: STM32 (U2.42), Cherry MX (D1.1 D4.1 D7.1)
CH_ROW1: STM32 (U2.18), Cherry MX (SW1.1 SW2.1 SW3.1)
CH_ROW2: STM32 (U2.19), Cherry MX (SW4.1 SW5.1 SW6.1)
CH_ROW3: STM32 (U2.20), Cherry MX (SW7.1 SW8.1 SW9.1)
D_IN: STM32 (U2.11), ws2182b LED string (R11.1)
DIN_EXT: Keypadmacro (P2.2), STM32 (U2.12)
MIC_OUT_TO_CONTROLLER: Sound Intimator (C2.2), STM32 (U2.10)